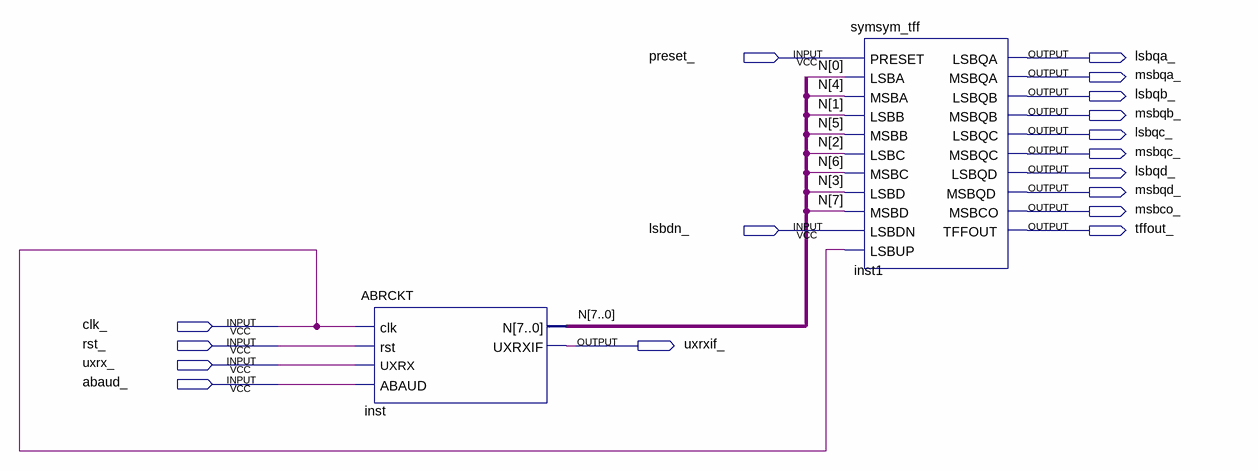
[diagram p0: schematic sheet]
// Quartus schematic BRGCKT.bdf as structural Verilog: 2 symbols, 17 pins
module BRGCKT (
  input  preset_,
  input  lsbdn_,
  input  clk_,
  input  rst_,
  input  uxrx_,
  input  abaud_,
  output lsbqa_,
  output msbqa_,
  output lsbqb_,
  output msbqb_,
  output lsbqc_,
  output msbqc_,
  output lsbqd_,
  output msbqd_,
  output msbco_,
  output tffout_,
  output uxrxif_
);

  wire [7:0] N;

  ABRCKT inst (.clk(clk_), .rst(rst_), .UXRX(uxrx_), .ABAUD(abaud_), .N(N), .UXRXIF(uxrxif_));
  symsym_tff inst1 (
    .PRESET(preset_), .LSBA(N[0]), .MSBA(N[4]), .LSBB(N[1]), .MSBB(N[5]), .LSBC(N[2]), .MSBC(N[6]),
    .LSBD(N[3]), .MSBD(N[7]), .LSBDN(lsbdn_), .LSBUP(clk_), .LSBQA(lsbqa_), .MSBQA(msbqa_), .LSBQB(lsbqb_),
    .MSBQB(msbqb_), .LSBQC(lsbqc_), .MSBQC(msbqc_), .LSBQD(lsbqd_), .MSBQD(msbqd_), .TFFOUT(tffout_),
    .MSBCO(msbco_));
endmodule
